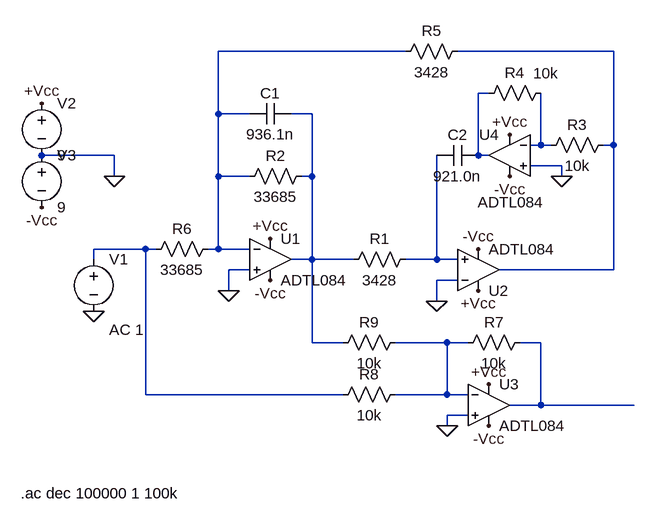
[diagram p0: schematic NOTCH.asc]
NOTCH.asc, the LTspice schematic file:
Version 4.1
SHEET 1 880 680
WIRE 320 -160 32 -160
WIRE 640 -160 400 -160
WIRE 448 -96 432 -96
WIRE 32 -64 32 -160
WIRE 80 -64 32 -64
WIRE 176 -64 144 -64
WIRE 528 -16 528 -96
WIRE 528 -16 512 -16
WIRE 544 -16 528 -16
WIRE 640 -16 640 -160
WIRE 640 -16 624 -16
WIRE -128 0 -240 0
WIRE 432 0 432 -96
WIRE 448 0 432 0
WIRE 560 16 512 16
WIRE -128 32 -128 0
WIRE 32 32 32 -64
WIRE 80 32 32 32
WIRE 176 32 176 -64
WIRE 176 32 160 32
WIRE 560 32 560 16
WIRE -80 144 -160 144
WIRE -64 144 -80 144
WIRE 32 144 32 32
WIRE 32 144 16 144
WIRE 80 144 32 144
WIRE -160 160 -160 144
WIRE 176 160 176 32
WIRE 176 160 144 160
WIRE 240 160 176 160
WIRE 368 160 368 0
WIRE 368 160 320 160
WIRE 400 160 368 160
WIRE 80 176 48 176
WIRE 640 176 640 -16
WIRE 640 176 464 176
WIRE 400 192 368 192
WIRE 48 208 48 176
WIRE 368 224 368 192
WIRE 176 288 176 160
WIRE 224 288 176 288
WIRE 384 288 304 288
WIRE 416 288 384 288
WIRE 528 288 496 288
WIRE -80 368 -80 144
WIRE 224 368 -80 368
WIRE 384 368 384 288
WIRE 384 368 304 368
WIRE 416 368 384 368
WIRE 528 384 528 288
WIRE 528 384 480 384
WIRE 672 384 528 384
WIRE 416 400 384 400
WIRE 384 416 384 400
FLAG 368 224 0
FLAG 384 416 0
FLAG 48 208 0
FLAG 560 32 0
FLAG -128 32 0
FLAG -240 80 -Vcc
FLAG 112 192 -Vcc
FLAG 432 144 -Vcc
FLAG 480 32 -Vcc
FLAG 448 416 -Vcc
FLAG -240 -80 +Vcc
FLAG 112 128 +Vcc
FLAG 432 208 +Vcc
FLAG 448 352 +Vcc
FLAG 480 -32 +Vcc
FLAG -160 240 0
SYMBOL OpAmps\\ADTL084 112 96 R0
SYMATTR InstName U1
SYMBOL OpAmps\\ADTL084 432 240 M180
SYMATTR InstName U2
SYMBOL res 336 144 R90
WINDOW 0 0 56 VBottom 2
WINDOW 3 32 56 VTop 2
SYMATTR InstName R1
SYMATTR Value 3428
SYMBOL OpAmps\\ADTL084 448 320 R0
SYMATTR InstName U3
SYMBOL OpAmps\\ADTL084 480 -64 M0
WINDOW 3 -53 136 Left 2
SYMATTR InstName U4
SYMBOL res 176 16 R90
WINDOW 0 0 56 VBottom 2
WINDOW 3 32 56 VTop 2
SYMATTR InstName R2
SYMATTR Value 33685
SYMBOL cap 144 -80 R90
WINDOW 0 0 32 VBottom 2
WINDOW 3 32 32 VTop 2
SYMATTR InstName C1
SYMATTR Value 936.1n
SYMBOL res 640 -32 R90
WINDOW 0 0 56 VBottom 2
WINDOW 3 32 56 VTop 2
SYMATTR InstName R3
SYMATTR Value 10k
SYMBOL res 544 -112 R90
WINDOW 0 0 56 VBottom 2
WINDOW 3 -30 8 VTop 2
SYMATTR InstName R4
SYMATTR Value 10k
SYMBOL cap 432 -16 R90
WINDOW 0 0 32 VBottom 2
WINDOW 3 32 32 VTop 2
SYMATTR InstName C2
SYMATTR Value 921.0n
SYMBOL res 416 -176 R90
WINDOW 0 0 56 VBottom 2
WINDOW 3 32 56 VTop 2
SYMATTR InstName R5
SYMATTR Value 3428
SYMBOL res 32 128 R90
WINDOW 0 0 56 VBottom 2
WINDOW 3 32 56 VTop 2
SYMATTR InstName R6
SYMATTR Value 33685
SYMBOL voltage -160 144 R0
WINDOW 123 24 124 Left 2
WINDOW 39 0 0 Left 0
SYMATTR InstName V1
SYMATTR Value ""
SYMATTR Value2 AC 1
SYMBOL voltage -240 -96 R0
WINDOW 123 0 0 Left 0
WINDOW 39 0 0 Left 0
SYMATTR InstName V2
SYMATTR Value 9
SYMBOL voltage -240 -16 R0
WINDOW 123 0 0 Left 0
WINDOW 39 0 0 Left 0
SYMATTR InstName V3
SYMATTR Value 9
SYMBOL res 512 272 R90
WINDOW 0 0 56 VBottom 2
WINDOW 3 32 56 VTop 2
SYMATTR InstName R7
SYMATTR Value 10k
SYMBOL res 320 352 R90
WINDOW 0 0 56 VBottom 2
WINDOW 3 32 56 VTop 2
SYMATTR InstName R8
SYMATTR Value 10k
SYMBOL res 320 272 R90
WINDOW 0 0 56 VBottom 2
WINDOW 3 32 56 VTop 2
SYMATTR InstName R9
SYMATTR Value 10k
TEXT -272 520 Left 2 !.ac dec 100000 1 100k

The netlist it stands for:
* NOTCH.asc
X§U1 0 N001 +Vcc -Vcc N004 ADTL084  ; pins In+ In- V+ V- OUT
X§U2 N007 0 +Vcc -Vcc N002 ADTL084  ; pins In+ In- V+ V- OUT
R1 N007 N004 3428
X§U3 0 N008 +Vcc -Vcc N009 ADTL084  ; pins In+ In- V+ V- OUT
X§U4 0 N005 +Vcc -Vcc N003 ADTL084  ; pins In+ In- V+ V- OUT
R2 N004 N001 33685
C1 N004 N001 936.1n
R3 N002 N005 10k
R4 N005 N003 10k
C2 N003 N007 921.0n
R5 N002 N001 3428
R6 N001 N006 33685
V1 N006 0 AC 1
V2 +Vcc 0 9
V3 0 -Vcc 9
R7 N009 N008 10k
R8 N008 N006 10k
R9 N008 N004 10k
.ac dec 100000 1 100k
.lib ADTL084.lib
.backanno
.end